# EAGLE schematic Oscillator+Counter (EAGLE 7.3.0)
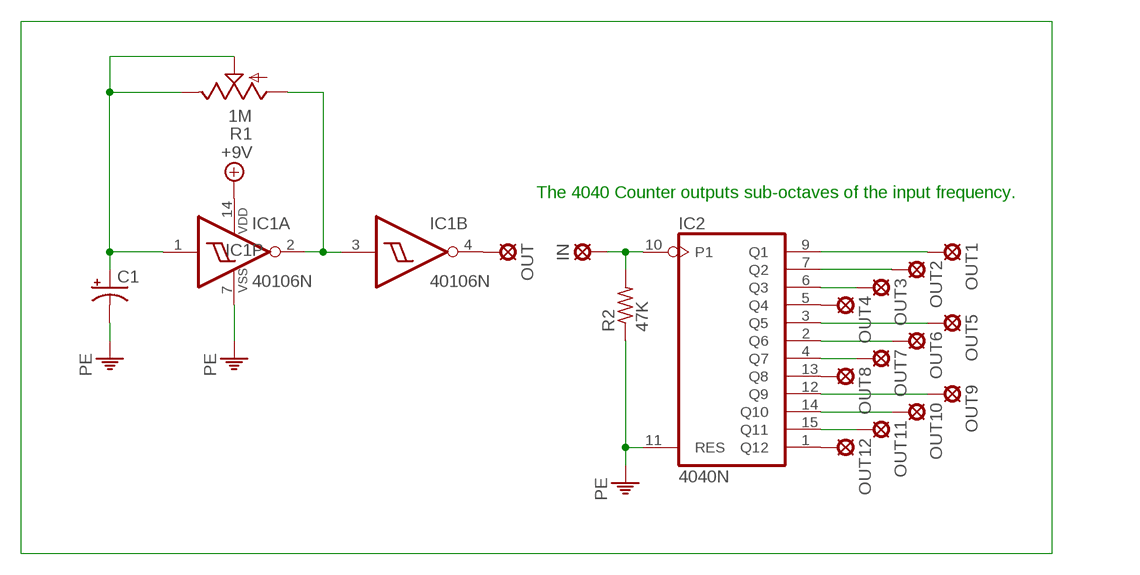
[diagram p0: schematic, sheet 1]

## Parts
C1  CPOL-USE2,5-6E  [E2,5-6E]
IC1  40106N  [DIL14]
IC2  4040N  [DIL16]
IN  MCS10B  [MCS10B]
OUT  MCS10B  [MCS10B]
OUT1  MCS10B  [MCS10B]
OUT2  MCS10B  [MCS10B]
OUT3  MCS10B  [MCS10B]
OUT4  MCS10B  [MCS10B]
OUT5  MCS10B  [MCS10B]
OUT6  MCS10B  [MCS10B]
OUT7  MCS10B  [MCS10B]
OUT8  MCS10B  [MCS10B]
OUT9  MCS10B  [MCS10B]
OUT10  MCS10B  [MCS10B]
OUT11  MCS10B  [MCS10B]
OUT12  MCS10B  [MCS10B]
R1  1M  US-EVUF2A  [EVUF]
R2  47K  R-US_0204/7  [0204/7]

## Nets
+9V: IC1.14(P:VDD)
N$1: C1.+ IC1.1(A:I) R1.2(S) R1.3(E)
N$2: IC2.10(P1) IN.MP R2.2
N$3: IC1.2(A:O) IC1.3(B:I) R1.1(A)
N$4: IC1.4(B:O) OUT.MP
N$5: IC2.9(Q1) OUT1.MP
N$6: IC2.7(Q2) OUT2.MP
N$7: IC2.5(Q4) OUT4.MP
N$8: IC2.6(Q3) OUT3.MP
N$9: IC2.3(Q5) OUT5.MP
N$10: IC2.2(Q6) OUT6.MP
N$11: IC2.4(Q7) OUT7.MP
N$12: IC2.13(Q8) OUT8.MP
N$13: IC2.1(Q12) OUT12.MP
N$14: IC2.15(Q11) OUT11.MP
N$15: IC2.14(Q10) OUT10.MP
N$16: IC2.12(Q9) OUT9.MP
PE: C1.- IC1.7(P:VSS) IC2.11(RES) R2.1
Unconnected: IC1.5(C:I) IC1.6(C:O) IC1.8(D:O) IC1.9(D:I) IC1.10(E:O) IC1.11(E:I) IC1.12(F:O) IC1.13(F:I)

## Notes on the sheet
- The 4040 Counter outputs sub-octaves of the input frequency.

## Power pins joined to a net without a drawn wire
VDD: IC2.16(VDD)
VSS: IC2.8(VSS)

## Library data of the parts
C1 = rcl:CPOL-US: POLARIZED CAPACITOR, American symbol
IC1 = 40xx:40106: Hex SCHMITT TRIGGER
IC2 = 40xx:4040: 12-stage binary/ripple COUNTER
IN OUT OUT1-OUT12 = solpad:MCS10B: SOLDER PAD MC S1, distributor Buerklin, 15F505
R1 = pot:US-EVU: 9 mm Square Rotary Potentiometers Source: Panasonic
R2 = rcl:R-US_: RESISTOR, American symbol